# Altium schematic sheet [12] - CAN.SchDoc
size A3; DocumentNumber: 12; SheetNumber: 12; SheetTotal: 18
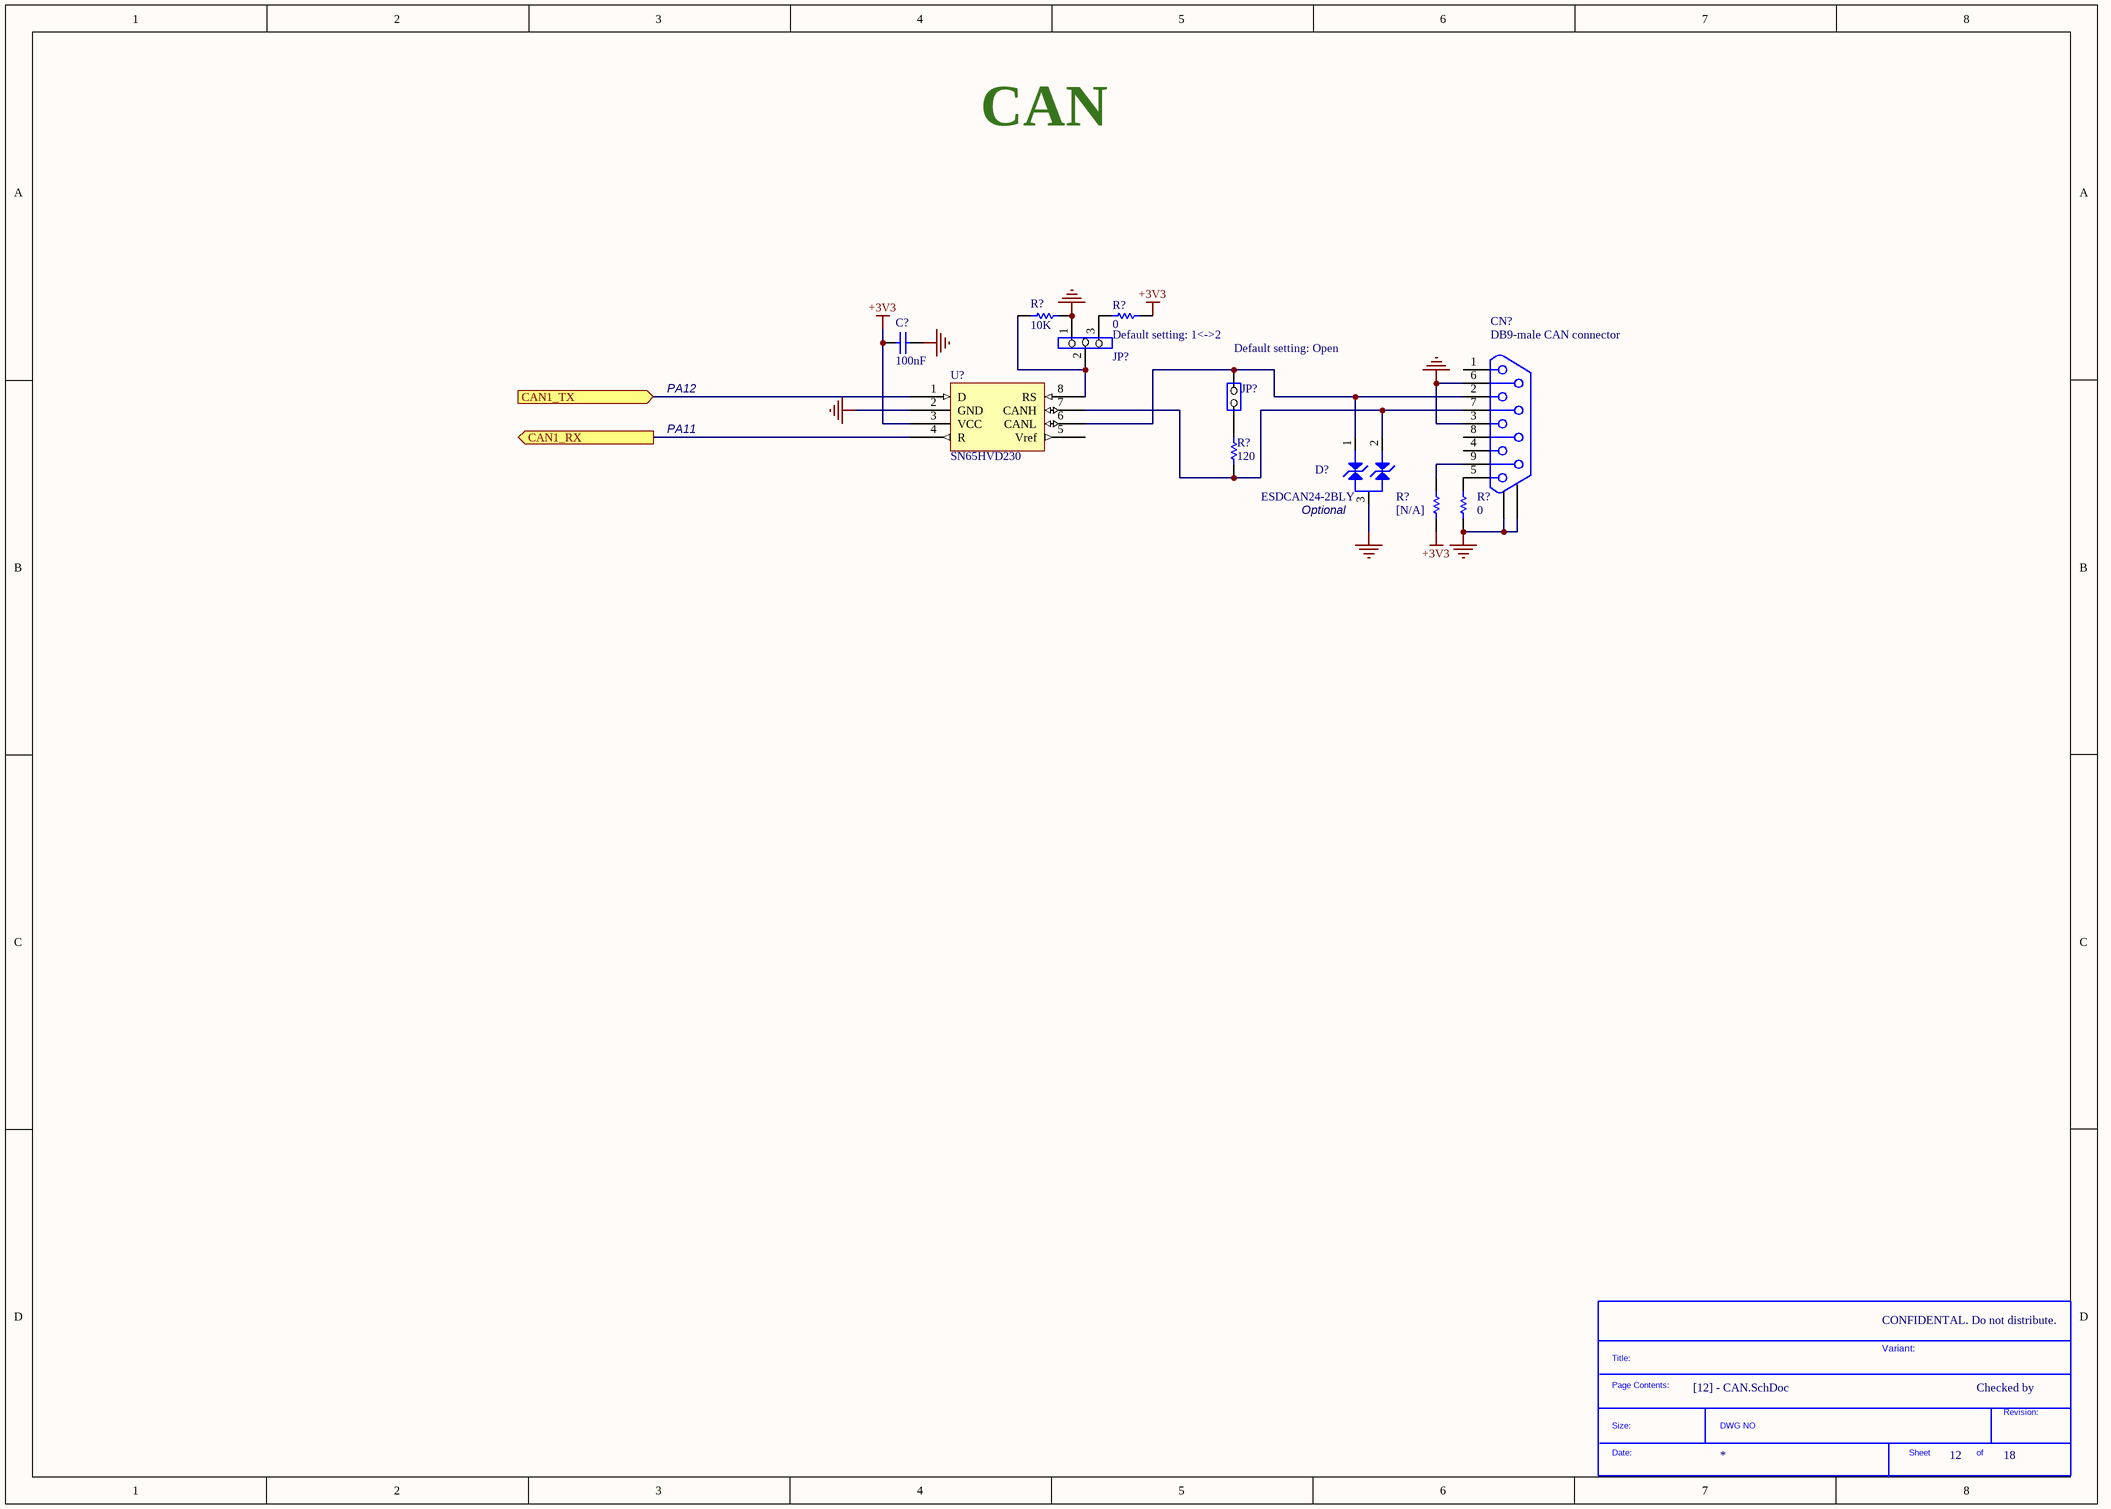
[diagram p0: [12] - CAN.SchDoc]

## Parts
(Parts that share a designator on the sheet are numbered #1, #2 ... from top to bottom, then left to right.)
*  SDTitleBlock  (value not drawn)  (graphical)
C?  100nF  [0603C]
CN?  DB9-male CAN connector  [DB9/M]
D?  ESDCAN24-2BLY  [SOT-23]
JP?#1  (no value)  [SIP3]
JP?#2  (no value)  [SIP2]
R?#1  10K  [0603R]
R?#2  0  [0603R]
R?#3  120  [0603R]
R?#4  [N/A]  [0603R]
R?#5  0  [0603R]
U?  SN65HVD230  [SOIC8_1R27_4R9X6]

## Ports
CAN1_RX (out), CAN1_TX (in)

## Nets
+3V3: C?.1 R?#2.2 R?#4.1 U?.3(VCC)
GND: C?.2 CN?.3 CN?.6 CN?.10 CN?.11 D?.3 JP?#1.1 R?#1.2 R?#5.1 U?.2(GND)
CAN1_RX: U?.4(R) ; port CAN1_RX
CAN1_TX: U?.1(D) ; port CAN1_TX
NetCN?_2: CN?.2 D?.1 JP?#2.2(NO) U?.6(CANL)
NetCN?_5: CN?.5 R?#5.2
NetCN?_7: CN?.7 D?.2 R?#3.1 U?.7(CANH)
NetCN?_9: CN?.9 R?#4.2
NetJP?#1_2: JP?#1.2 R?#1.1 U?.8(RS)
NetJP?#1_3: JP?#1.3 R?#2.1
NetJP?#2_1: JP?#2.1(COMMON) R?#3.2

Not connected (* = marked no-connect by the designer): CN? 1 4 8; U? 5(Vref)

## Notes on the sheet
- CAN
- Default setting: 1<->2
- (near JP?#2) Default setting: Open
- PA12
- PA11
- (near D?) Optional
- CONFIDENTAL. Do not distribute.
- CLOCKS (CPU & PCIE)
- Variant:
- Checked by
- (in symbol SDTitleBlock) Title:; Page Contents:; Revision:; Size:; DWG NO; Date:; Sheet; of

## Library data of the parts
C? = Cap: Capacitor; Value: 10nF; Published: 8-Jun-2000; Revision: July-2002: Re-released for DXP Platform.; Publisher: Altium Limited
CN? = DB9-CAN
JP?#1 = Jumper3
JP?#2 = JP2
R?#1 = Res1: Resistor; Value: 1K; Published: 8-Jun-2000; Revision: July-2002: Re-released for DXP Platform.; Publisher: Altium Limited
R?#2-R?#5 = res1: Resistor; Value: 1K; Published: 8-Jun-2000; Revision: July-2002: Re-released for DXP Platform.; Publisher: Altium Limited
U? = SN65HVD230D